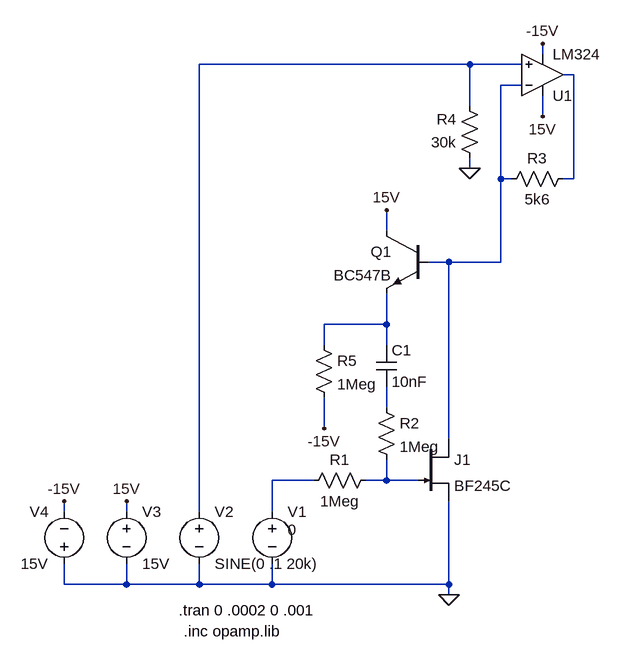
[diagram p0: schematic VCA circuit v2.asc]
VCA circuit v2.asc, the LTspice schematic file:
Version 4
SHEET 1 880 680
WIRE 416 -448 416 -464
WIRE 304 -432 -112 -432
WIRE 384 -432 304 -432
WIRE 464 -416 448 -416
WIRE 384 -400 352 -400
WIRE 304 -368 304 -432
WIRE 416 -352 416 -384
WIRE 304 -272 304 -288
WIRE 352 -256 352 -400
WIRE 368 -256 352 -256
WIRE 464 -256 464 -416
WIRE 464 -256 448 -256
WIRE 176 -176 176 -208
WIRE 272 -128 240 -128
WIRE 352 -128 352 -256
WIRE 352 -128 272 -128
WIRE 176 -32 176 -80
WIRE 176 -32 80 -32
WIRE 80 0 80 -32
WIRE 176 0 176 -32
WIRE 176 96 176 64
WIRE 80 128 80 80
WIRE 272 144 272 -128
WIRE 64 208 0 208
WIRE 176 208 176 176
WIRE 176 208 144 208
WIRE 224 208 176 208
WIRE -320 256 -320 240
WIRE -224 256 -224 240
WIRE -112 256 -112 -432
WIRE 0 256 0 208
WIRE -320 368 -320 336
WIRE -224 368 -224 336
WIRE -224 368 -320 368
WIRE -112 368 -112 336
WIRE -112 368 -224 368
WIRE 0 368 0 336
WIRE 0 368 -112 368
WIRE 272 368 272 240
WIRE 272 368 0 368
WIRE 272 384 272 368
FLAG 272 384 0
FLAG 416 -352 15V
FLAG 416 -464 -15V
FLAG -224 240 15V
FLAG -320 240 -15V
FLAG 304 -272 0
FLAG 176 -208 15V
FLAG 80 128 -15V
SYMBOL njf 224 144 R0
SYMATTR InstName J1
SYMATTR Value BF245C
SYMBOL voltage 0 240 R0
WINDOW 3 24 44 Left 2
WINDOW 123 0 0 Left 0
WINDOW 39 0 0 Left 0
SYMATTR Value 0
SYMATTR InstName V1
SYMBOL res 160 192 R90
WINDOW 0 0 56 VBottom 2
WINDOW 3 32 56 VTop 2
SYMATTR InstName R1
SYMATTR Value 1Meg
SYMBOL res 160 80 R0
SYMATTR InstName R2
SYMATTR Value 1Meg
SYMBOL cap 160 0 R0
SYMATTR InstName C1
SYMATTR Value 10nF
SYMBOL voltage -112 240 R0
WINDOW 123 0 0 Left 0
WINDOW 39 0 0 Left 0
SYMATTR InstName V2
SYMATTR Value SINE(0 .1 20k)
SYMBOL Opamps\\opamp2 416 -352 M180
SYMATTR InstName U1
SYMATTR Value LM324
SYMBOL voltage -224 240 R0
WINDOW 123 0 0 Left 0
WINDOW 39 0 0 Left 0
SYMATTR InstName V3
SYMATTR Value 15V
SYMBOL voltage -320 352 R180
WINDOW 0 24 96 Left 2
WINDOW 3 24 16 Left 2
WINDOW 123 0 0 Left 0
WINDOW 39 0 0 Left 0
SYMATTR InstName V4
SYMATTR Value 15V
SYMBOL res 464 -272 R90
WINDOW 0 0 56 VBottom 2
WINDOW 3 32 56 VTop 2
SYMATTR InstName R3
SYMATTR Value 5k6
SYMBOL res 320 -272 R180
WINDOW 0 36 76 Left 2
WINDOW 3 36 40 Left 2
SYMATTR InstName R4
SYMATTR Value 30k
SYMBOL npn 240 -176 M0
SYMATTR InstName Q1
SYMATTR Value BC547B
SYMBOL res 64 -16 R0
SYMATTR InstName R5
SYMATTR Value 1Meg
TEXT -144 408 Left 2 !.tran 0 .0002 0 .001
TEXT -136 440 Left 2 !.inc opamp.lib

The netlist it stands for:
* VCA circuit v2.asc
J1 N003 N007 0 BF245C
V1 N006 0 0
R1 N007 N006 1Meg
R2 N005 N007 1Meg
C1 N004 N005 10nF
V2 N001 0 SINE(0 .1 20k)
XU1 N001 N003 15V -15V N002 LM324  ; pins In+ In- V+ V- OUT
V3 15V 0 15V
V4 0 -15V 15V
R3 N002 N003 5k6
R4 0 N001 30k
Q1 15V N003 N004 0 BC547B
R5 N004 -15V 1Meg
.model NPN NPN
.model PNP PNP
.lib standard.bjt
.model NJF NJF
.model PJF PJF
.lib standard.jft
.tran 0 .0002 0 .001
.inc opamp.lib
.backanno
.end